# Altium schematic sheet SchemeAcSensor.SchDoc: Наименование
size 420 x 297 mm; ApprovedBy: Утвердил; CheckedBy: Проверил; Author: Разработал; CompanyName: Организация; DrawnBy: Н.Контр; Engineer: Т.Контр; SheetNumber: 1; SheetTotal: 1; PageSetup: Record=PageOptions|CenterHorizontal=True|CenterVertical=True|PrintScale=0.94|XCorrection=1.00|YCorrection=1.00|PrintKind=1|BorderSize=5000000|LeftOffset=0|BottomOffset=0|Orientation=1|PaperLength=1000|PaperWidth=1000|Scale=100|PaperSource=7|PrintQuality=-4|MediaType=1|DitherType=10|PaperKind=A4|PrintScaleMode=1; DecimalNumber: Децимальный номер; HeadOfSector: Нач. сектора; MainDevice: Перв.примен.; Name: Наименование; DocumentName: Sheet1.SCHDOC
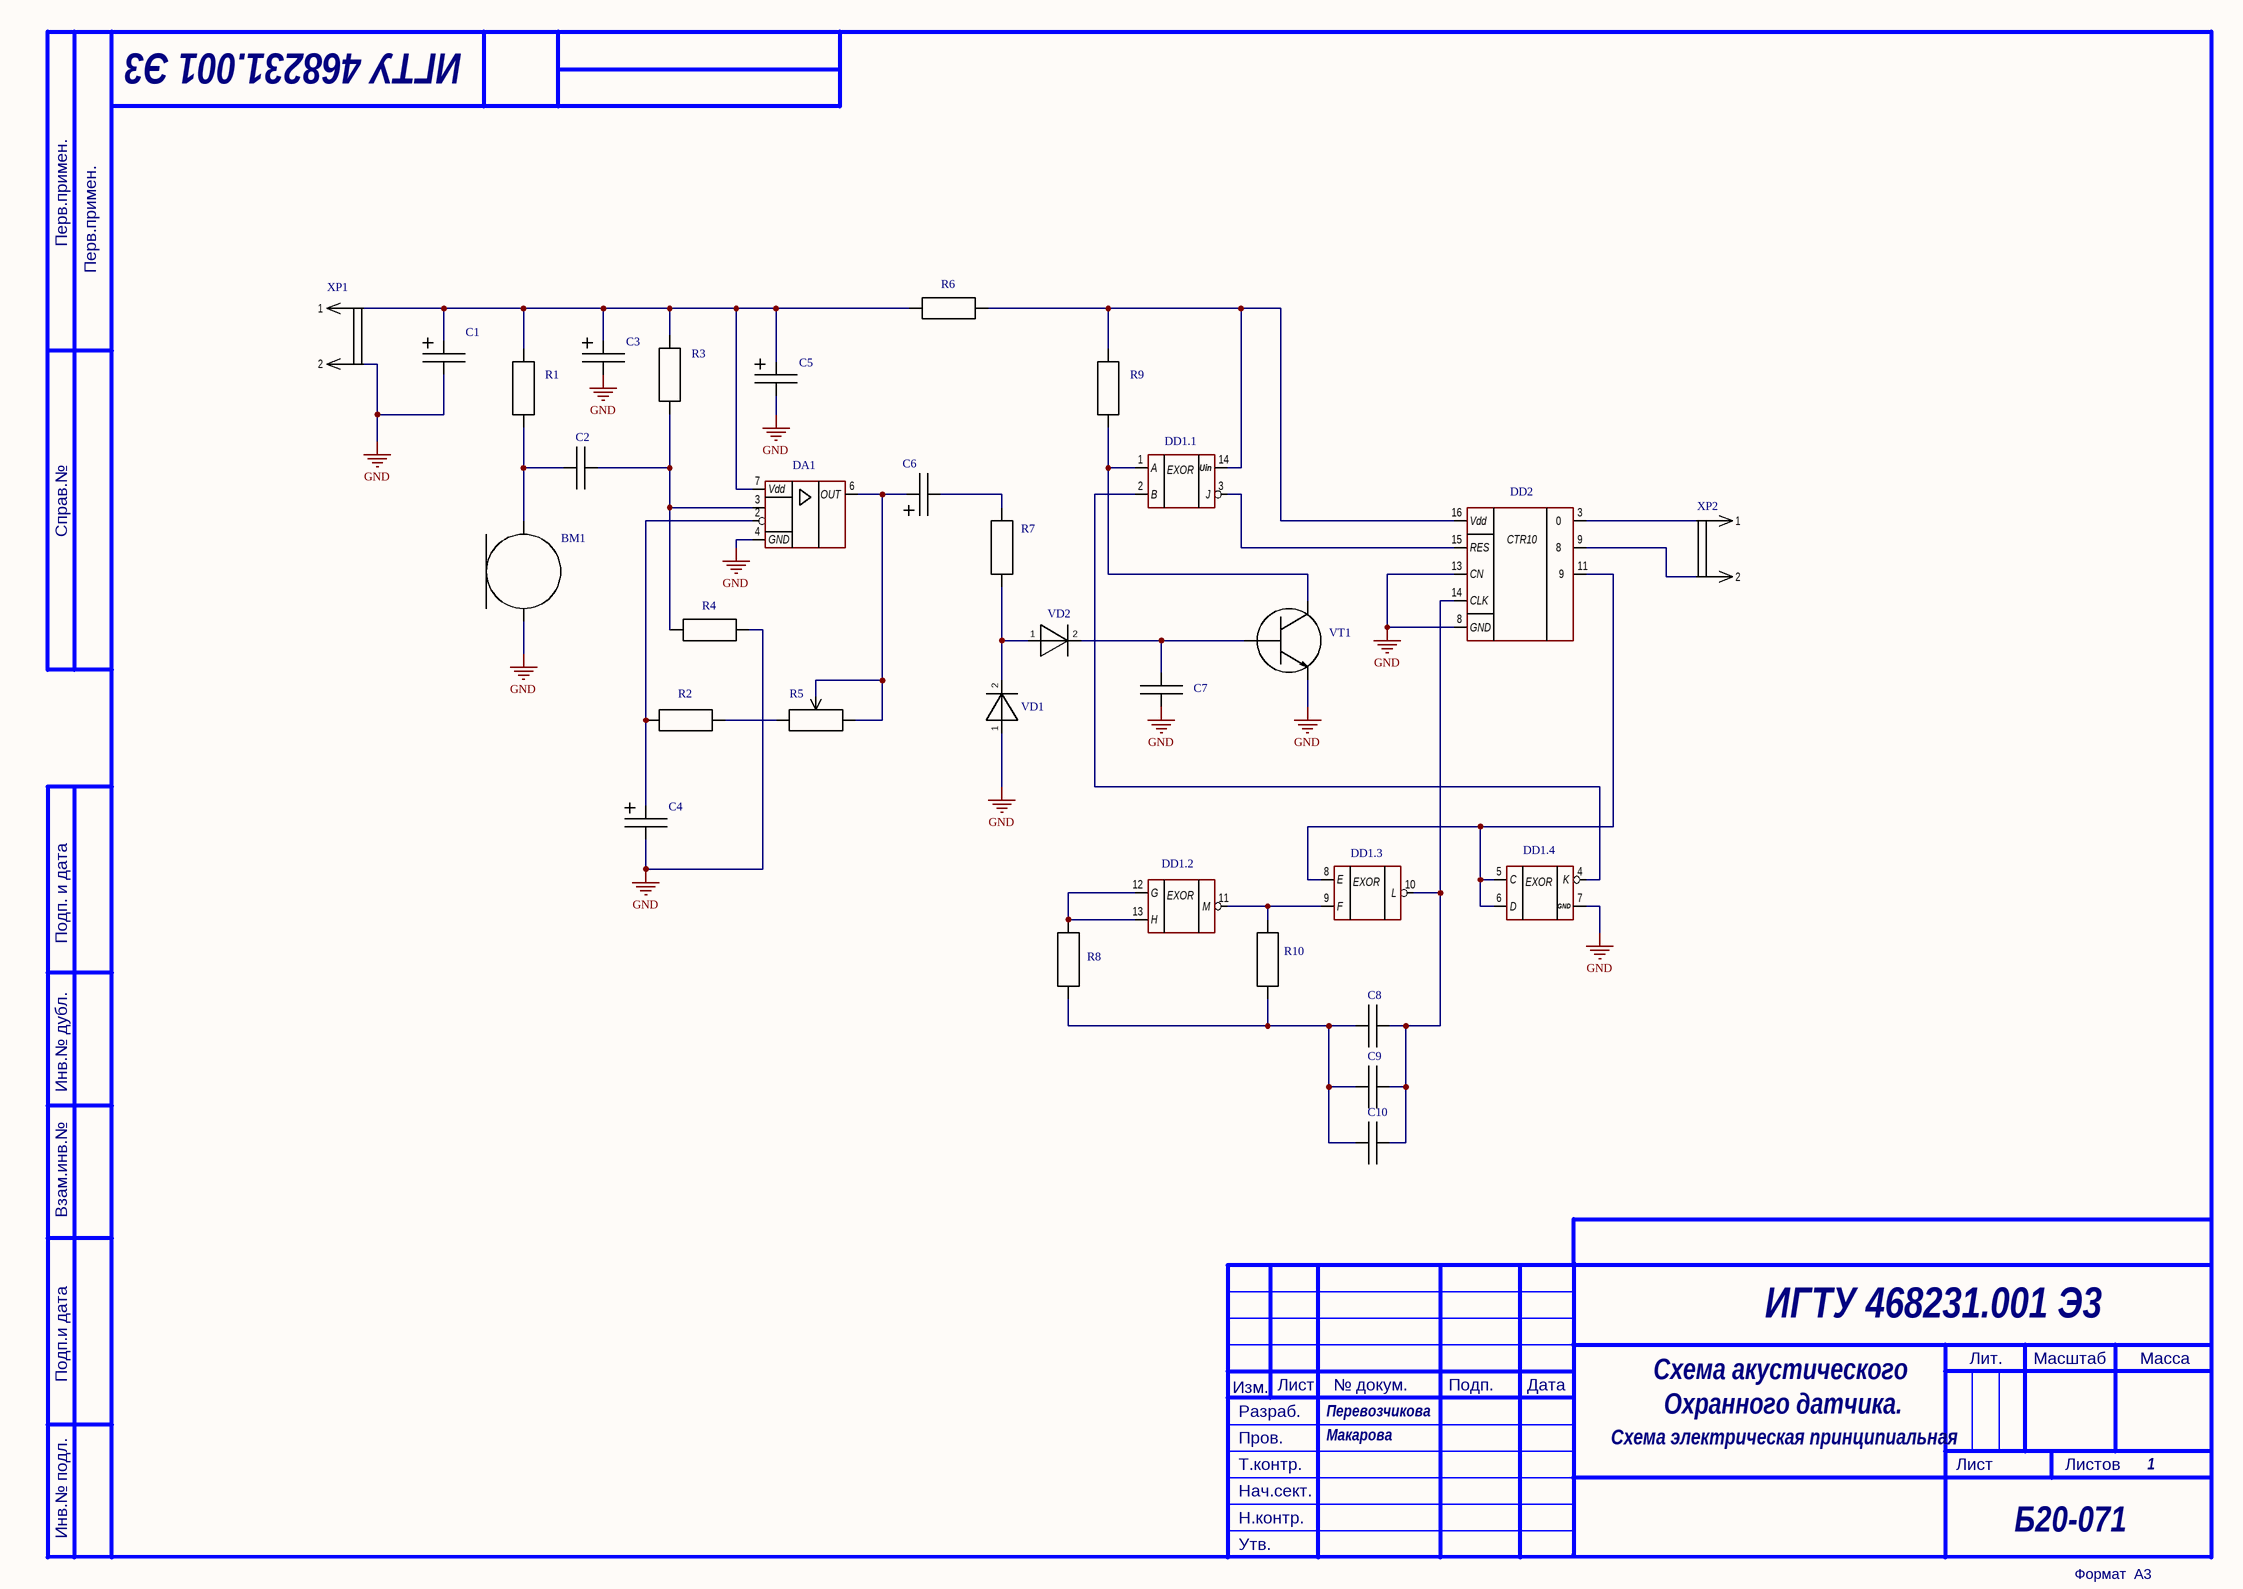
[diagram p0: SchemeAcSensor.SchDoc]

## Parts
BM1  Micro  [electret_micro]  (value not drawn)
C1  470 mF  [CAPA_Polar]  (value not drawn)
C2  Capacitor  [CAPA_1206]  (value not drawn)
C3  Capacitor_polar  [CAPA_К50-35]  (value not drawn)
C4  Capacitor_polar  [CAPA_К50-35]  (value not drawn)
C5  Capacitor_polar  [CAPA_К50-35]  (value not drawn)
C6  Capacitor_polar  [CAPA_К50-35]  (value not drawn)
C7  Capacitor  [CAPA_1206]  (value not drawn)
C8  Capacitor  [CAPA_1206]  (value not drawn)
C9  Capacitor  [CAPA_1206]  (value not drawn)
C10  Capacitor  [CAPA_1206]  (value not drawn)
DA1  OperationalAmplifire  [OPERATION_AMPLIFIRE]  (value not drawn)
DD1  DD1.1  [CD4001B_DIP]  (parts A,B,C,D of 4)
DD2  CD4017  [CB4017B]  (value not drawn)
R1  Res  [RES0805]  (value not drawn)
R2  Res  [RES0805]  (value not drawn)
R3  Res  [RES0805]  (value not drawn)
R4  Res  [RES0805]  (value not drawn)
R5  Potentiometer  [POTENTIOMETER]  (value not drawn)
R6  Res  [RES0805]  (value not drawn)
R7  Res  [RES0805]  (value not drawn)
R8  Res  [RES0805]  (value not drawn)
R9  Res  [RES0805]  (value not drawn)
R10  Res  [RES_output]  (value not drawn)
VD1  Diod  [DIODE]  (value not drawn)
VD2  Diod  [DIODE]  (value not drawn)
VT1  NPN  [TRANSISTOR_KT3102]  (value not drawn)
XP1  InputOutput  [INPUT_OUTPUT_CWF-2R]  (value not drawn)
XP2  InputOutput  [INPUT_OUTPUT_CWF-2R]  (value not drawn)

## Nets
GND: BM1.1 C1.1 C3.1 C4.1 C5.1 C7.1 DA1.4(GND) DD1.7(GND) DD2.8(GND) DD2.13(CN) R4.1 VD1.1 VT1.3 XP1.2
NetBM1_2: BM1.2 C2.1 R1.1
NetC1_2: C1.2 C3.2 C5.2 DA1.7(Vdd) R1.2 R3.2 R6.2 XP1.1
NetC2_2: C2.2 DA1.3 R3.1 R4.2
NetC4_2: C4.2 DA1.2 R2.1
NetC6_1: C6.1 R7.2
NetC6_2: C6.2 DA1.6(OUT) R5.2 R5.3
NetC7_2: C7.2 VD2.2 VT1.1
NetC8_1: C8.1 C9.1 C10.1 R8.1 R10.1
NetC8_2: C8.2 C9.2 C10.2 DD1.10(L) DD2.14(CLK)
NetDD1_1: DD1.1(A) R9.1 VT1.2
NetDD1_2: DD1.2(B) DD1.4(K)
NetDD1_3: DD1.3(J) DD2.15(RES)
NetDD1_5: DD1.5(C) DD1.6(D) DD1.8(E) DD2.11(9)
NetDD1_9: DD1.9(F) DD1.11(M) R10.2
NetDD1_12: DD1.12(G) DD1.13(H) R8.2
NetDD1_14: DD1.14(Uin) DD2.16(Vdd) R6.1 R9.2
NetDD2_3: DD2.3(0) XP2.1
NetDD2_9: DD2.9(8) XP2.2
NetR2_2: R2.2 R5.1
NetR7_1: R7.1 VD1.2 VD2.1

## Notes on the sheet
- 1
- ИГТУ 468231.001 Э3
- Перв.примен.
- Справ.№
- Подп. и дата
- Инв.№ дубл.
- Взам.инв.№
- Подп.и дата
- Разраб.
- Изм.
- Лист
- № докум.
- Подп.
- Дата
- Схема акустического
- Лит.
- Масштаб
- Масса
- Т.контр.
- Пров.
- Перевозчикова
- Макарова
- Схема электрическая принципиальная
- Охранного датчика.
- Листов
- Инв.№ подл.
- Утв.
- Н.контр.
- Нач.сект.
- Б20-071
- Формат  A3
- (in symbol CD4001B, part A) EXOR
- (in symbol CD4001B, part B) EXOR
- (in symbol CD4001B, part C) EXOR
- (in symbol CD4001B, part D) EXOR
- (in symbol CD4017) CTR10

## Library data of the parts
C1 = Capacitor_polar
DD1 = CD4001B